# Altium schematic sheet LPCB224 - OVERVIEW.SchDoc
size A3; Address1: Factory 10; Address2: 9-13 Dingley Avenue, Dandeong, VICTORIA 3175, AUSTRALIA; DocumentNumber: 1; Revision: 1; SheetNumber: 1; SheetTotal: 7; Lockie__PCB_SUB_ASSEMBLY: Overview; Lockie__PCB_ASSEMBLY: Core Node; Lockie__LDL: LPCB224; Lockie__PCB_DESCRIPTION: Core Node
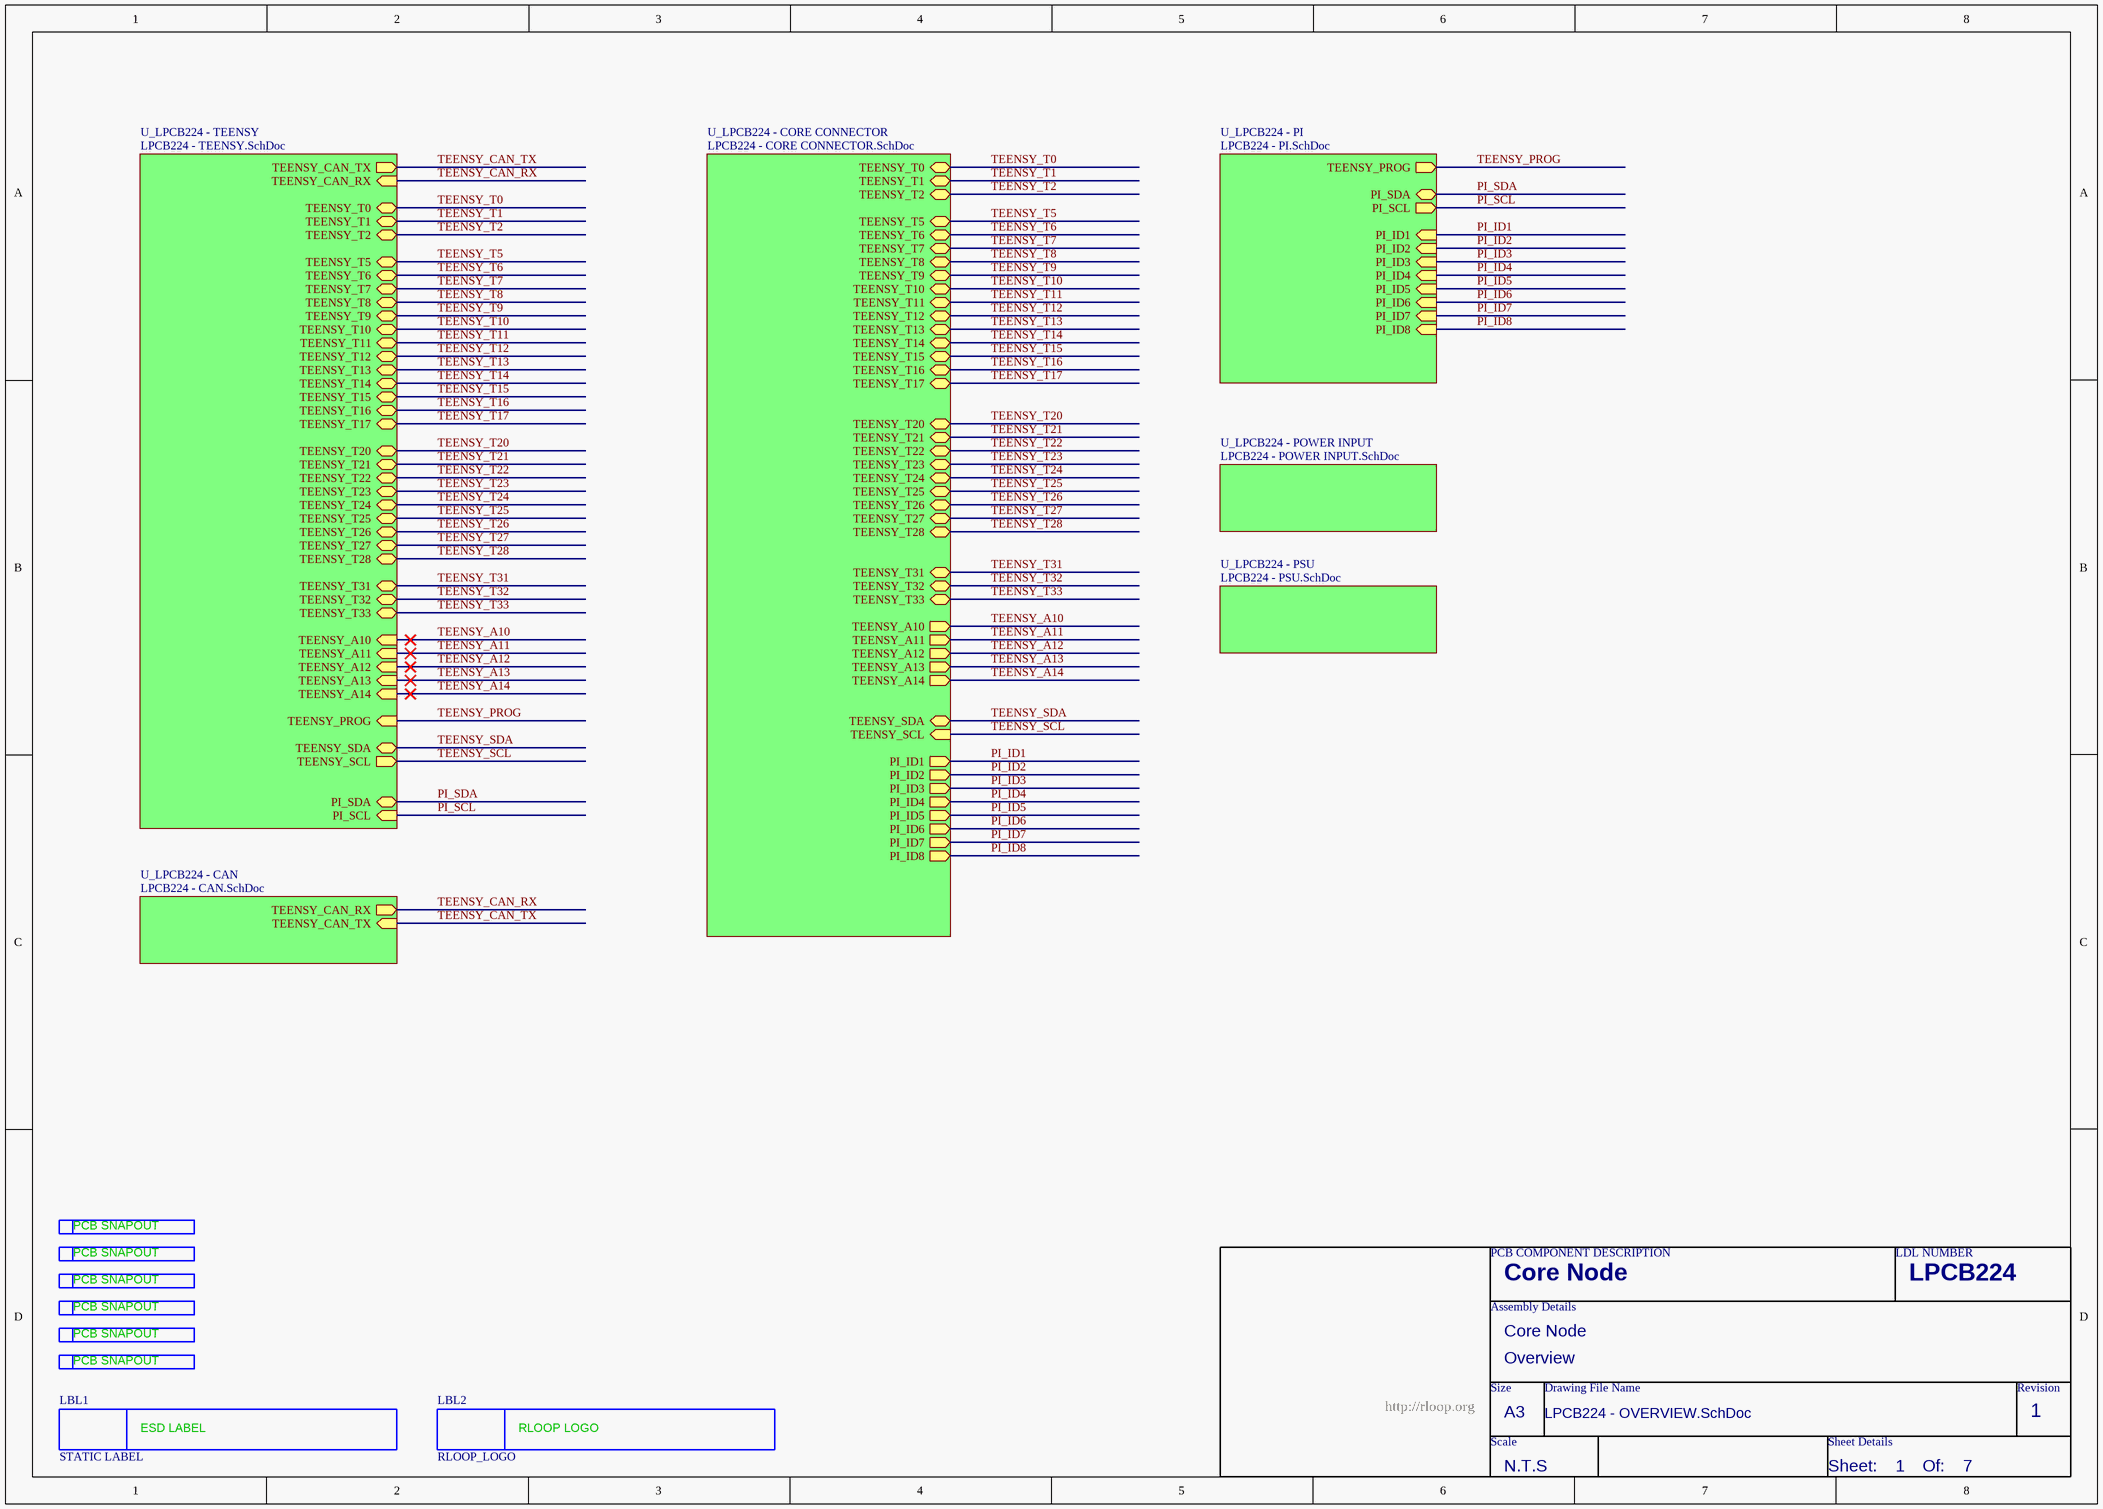
[diagram p0: LPCB224 - OVERVIEW.SchDoc]

## Parts
LBL1  STATIC LABEL  [STATIC_LABEL]  (no BOM)
LBL2  RLOOP_LOGO  [RLOOP_LOGO]  (no BOM)
SN1  PCB_SNAPOUT  [SNAPOUT_NEW]  (value not drawn)  (no BOM)
SN2  PCB_SNAPOUT  [SNAPOUT_NEW]  (value not drawn)  (no BOM)
SN3  PCB_SNAPOUT  [SNAPOUT_NEW]  (value not drawn)  (no BOM)
SN4  PCB_SNAPOUT  [SNAPOUT_NEW]  (value not drawn)  (no BOM)
SN5  PCB_SNAPOUT  [SNAPOUT_NEW]  (value not drawn)  (no BOM)
SN6  PCB_SNAPOUT  [SNAPOUT_NEW]  (value not drawn)  (no BOM)

## Sub-sheets
U_LPCB224 - CAN = LPCB224 - CAN.SchDoc: TEENSY_CAN_TX (in), TEENSY_CAN_RX (out)
U_LPCB224 - CORE CONNECTOR = LPCB224 - CORE CONNECTOR.SchDoc: TEENSY_T0 (bidir), TEENSY_T1 (bidir), TEENSY_T2 (bidir), TEENSY_T5 (bidir), TEENSY_T6 (bidir), TEENSY_T7 (bidir), TEENSY_T8 (bidir), TEENSY_T9 (bidir), TEENSY_T10 (bidir), TEENSY_T11 (bidir), TEENSY_T12 (bidir), TEENSY_T13 (bidir), TEENSY_T14 (bidir), TEENSY_T15 (bidir), TEENSY_T16 (bidir), TEENSY_T17 (bidir), TEENSY_T20 (bidir), TEENSY_T21 (bidir), TEENSY_T22 (bidir), TEENSY_T23 (bidir), TEENSY_T24 (bidir), TEENSY_T25 (bidir), TEENSY_T26 (bidir), TEENSY_T27 (bidir), TEENSY_T28 (bidir), TEENSY_T31 (bidir), TEENSY_T32 (bidir), TEENSY_T33 (bidir), TEENSY_A10 (out), TEENSY_A11 (out), TEENSY_A12 (out), TEENSY_A13 (out), TEENSY_A14 (out), TEENSY_SCL (in), TEENSY_SDA (bidir), PI_ID1 (out), PI_ID2 (out), PI_ID3 (out), PI_ID4 (out), PI_ID5 (out), PI_ID6 (out), PI_ID7 (out), PI_ID8 (out)
U_LPCB224 - PI = LPCB224 - PI.SchDoc: PI_ID1 (in), PI_ID2 (in), PI_ID3 (in), PI_ID4 (in), PI_ID5 (in), PI_ID6 (in), PI_ID7 (in), PI_ID8 (in), PI_SDA (bidir), PI_SCL (out), TEENSY_PROG (out)
U_LPCB224 - POWER INPUT = LPCB224 - POWER INPUT.SchDoc: no entries
U_LPCB224 - PSU = LPCB224 - PSU.SchDoc: no entries
U_LPCB224 - TEENSY = LPCB224 - TEENSY.SchDoc: TEENSY_T0 (bidir), TEENSY_T1 (bidir), TEENSY_T2 (bidir), TEENSY_CAN_TX (out), TEENSY_CAN_RX (in), TEENSY_T5 (bidir), TEENSY_T6 (bidir), TEENSY_T7 (bidir), TEENSY_T8 (bidir), TEENSY_T9 (bidir), TEENSY_T10 (bidir), TEENSY_T11 (bidir), TEENSY_T12 (bidir), TEENSY_T13 (bidir), TEENSY_T14 (bidir), TEENSY_T15 (bidir), TEENSY_T16 (bidir), TEENSY_T17 (bidir), TEENSY_T20 (bidir), TEENSY_T21 (bidir), TEENSY_T22 (bidir), TEENSY_T23 (bidir), TEENSY_T24 (bidir), TEENSY_T25 (bidir), TEENSY_T26 (bidir), TEENSY_T27 (bidir), TEENSY_T28 (bidir), TEENSY_T31 (bidir), TEENSY_T32 (bidir), TEENSY_T33 (bidir), TEENSY_A10 (in), TEENSY_A11 (in), TEENSY_A12 (in), TEENSY_A13 (in), TEENSY_A14 (in), TEENSY_PROG (in), TEENSY_SCL (out), TEENSY_SDA (bidir), PI_SCL (in), PI_SDA (bidir)

## Nets
PI_ID1: sheet U_LPCB224 - PI/PI_ID1, sheet U_LPCB224 - CORE CONNECTOR/PI_ID1
PI_ID2: sheet U_LPCB224 - PI/PI_ID2, sheet U_LPCB224 - CORE CONNECTOR/PI_ID2
PI_ID3: sheet U_LPCB224 - PI/PI_ID3, sheet U_LPCB224 - CORE CONNECTOR/PI_ID3
PI_ID4: sheet U_LPCB224 - PI/PI_ID4, sheet U_LPCB224 - CORE CONNECTOR/PI_ID4
PI_ID5: sheet U_LPCB224 - PI/PI_ID5, sheet U_LPCB224 - CORE CONNECTOR/PI_ID5
PI_ID6: sheet U_LPCB224 - PI/PI_ID6, sheet U_LPCB224 - CORE CONNECTOR/PI_ID6
PI_ID7: sheet U_LPCB224 - PI/PI_ID7, sheet U_LPCB224 - CORE CONNECTOR/PI_ID7
PI_ID8: sheet U_LPCB224 - PI/PI_ID8, sheet U_LPCB224 - CORE CONNECTOR/PI_ID8
PI_SCL: sheet U_LPCB224 - TEENSY/PI_SCL, sheet U_LPCB224 - PI/PI_SCL
PI_SDA: sheet U_LPCB224 - TEENSY/PI_SDA, sheet U_LPCB224 - PI/PI_SDA
TEENSY_A10: sheet U_LPCB224 - TEENSY/TEENSY_A10, sheet U_LPCB224 - CORE CONNECTOR/TEENSY_A10
TEENSY_A11: sheet U_LPCB224 - TEENSY/TEENSY_A11, sheet U_LPCB224 - CORE CONNECTOR/TEENSY_A11
TEENSY_A12: sheet U_LPCB224 - TEENSY/TEENSY_A12, sheet U_LPCB224 - CORE CONNECTOR/TEENSY_A12
TEENSY_A13: sheet U_LPCB224 - TEENSY/TEENSY_A13, sheet U_LPCB224 - CORE CONNECTOR/TEENSY_A13
TEENSY_A14: sheet U_LPCB224 - TEENSY/TEENSY_A14, sheet U_LPCB224 - CORE CONNECTOR/TEENSY_A14
TEENSY_CAN_RX: sheet U_LPCB224 - TEENSY/TEENSY_CAN_RX, sheet U_LPCB224 - CAN/TEENSY_CAN_RX
TEENSY_CAN_TX: sheet U_LPCB224 - TEENSY/TEENSY_CAN_TX, sheet U_LPCB224 - CAN/TEENSY_CAN_TX
TEENSY_PROG: sheet U_LPCB224 - TEENSY/TEENSY_PROG, sheet U_LPCB224 - PI/TEENSY_PROG
TEENSY_SCL: sheet U_LPCB224 - TEENSY/TEENSY_SCL, sheet U_LPCB224 - CORE CONNECTOR/TEENSY_SCL
TEENSY_SDA: sheet U_LPCB224 - TEENSY/TEENSY_SDA, sheet U_LPCB224 - CORE CONNECTOR/TEENSY_SDA
TEENSY_T0: sheet U_LPCB224 - TEENSY/TEENSY_T0, sheet U_LPCB224 - CORE CONNECTOR/TEENSY_T0
TEENSY_T1: sheet U_LPCB224 - TEENSY/TEENSY_T1, sheet U_LPCB224 - CORE CONNECTOR/TEENSY_T1
TEENSY_T2: sheet U_LPCB224 - TEENSY/TEENSY_T2, sheet U_LPCB224 - CORE CONNECTOR/TEENSY_T2
TEENSY_T5: sheet U_LPCB224 - TEENSY/TEENSY_T5, sheet U_LPCB224 - CORE CONNECTOR/TEENSY_T5
TEENSY_T6: sheet U_LPCB224 - TEENSY/TEENSY_T6, sheet U_LPCB224 - CORE CONNECTOR/TEENSY_T6
TEENSY_T7: sheet U_LPCB224 - TEENSY/TEENSY_T7, sheet U_LPCB224 - CORE CONNECTOR/TEENSY_T7
TEENSY_T8: sheet U_LPCB224 - TEENSY/TEENSY_T8, sheet U_LPCB224 - CORE CONNECTOR/TEENSY_T8
TEENSY_T9: sheet U_LPCB224 - TEENSY/TEENSY_T9, sheet U_LPCB224 - CORE CONNECTOR/TEENSY_T9
TEENSY_T10: sheet U_LPCB224 - TEENSY/TEENSY_T10, sheet U_LPCB224 - CORE CONNECTOR/TEENSY_T10
TEENSY_T11: sheet U_LPCB224 - TEENSY/TEENSY_T11, sheet U_LPCB224 - CORE CONNECTOR/TEENSY_T11
TEENSY_T12: sheet U_LPCB224 - TEENSY/TEENSY_T12, sheet U_LPCB224 - CORE CONNECTOR/TEENSY_T12
TEENSY_T13: sheet U_LPCB224 - TEENSY/TEENSY_T13, sheet U_LPCB224 - CORE CONNECTOR/TEENSY_T13
TEENSY_T14: sheet U_LPCB224 - TEENSY/TEENSY_T14, sheet U_LPCB224 - CORE CONNECTOR/TEENSY_T14
TEENSY_T15: sheet U_LPCB224 - TEENSY/TEENSY_T15, sheet U_LPCB224 - CORE CONNECTOR/TEENSY_T15
TEENSY_T16: sheet U_LPCB224 - TEENSY/TEENSY_T16, sheet U_LPCB224 - CORE CONNECTOR/TEENSY_T16
TEENSY_T17: sheet U_LPCB224 - TEENSY/TEENSY_T17, sheet U_LPCB224 - CORE CONNECTOR/TEENSY_T17
TEENSY_T20: sheet U_LPCB224 - TEENSY/TEENSY_T20, sheet U_LPCB224 - CORE CONNECTOR/TEENSY_T20
TEENSY_T21: sheet U_LPCB224 - TEENSY/TEENSY_T21, sheet U_LPCB224 - CORE CONNECTOR/TEENSY_T21
TEENSY_T22: sheet U_LPCB224 - TEENSY/TEENSY_T22, sheet U_LPCB224 - CORE CONNECTOR/TEENSY_T22
TEENSY_T23: sheet U_LPCB224 - TEENSY/TEENSY_T23, sheet U_LPCB224 - CORE CONNECTOR/TEENSY_T23
TEENSY_T24: sheet U_LPCB224 - TEENSY/TEENSY_T24, sheet U_LPCB224 - CORE CONNECTOR/TEENSY_T24
TEENSY_T25: sheet U_LPCB224 - TEENSY/TEENSY_T25, sheet U_LPCB224 - CORE CONNECTOR/TEENSY_T25
TEENSY_T26: sheet U_LPCB224 - TEENSY/TEENSY_T26, sheet U_LPCB224 - CORE CONNECTOR/TEENSY_T26
TEENSY_T27: sheet U_LPCB224 - TEENSY/TEENSY_T27, sheet U_LPCB224 - CORE CONNECTOR/TEENSY_T27
TEENSY_T28: sheet U_LPCB224 - TEENSY/TEENSY_T28, sheet U_LPCB224 - CORE CONNECTOR/TEENSY_T28
TEENSY_T31: sheet U_LPCB224 - TEENSY/TEENSY_T31, sheet U_LPCB224 - CORE CONNECTOR/TEENSY_T31
TEENSY_T32: sheet U_LPCB224 - TEENSY/TEENSY_T32, sheet U_LPCB224 - CORE CONNECTOR/TEENSY_T32
TEENSY_T33: sheet U_LPCB224 - TEENSY/TEENSY_T33, sheet U_LPCB224 - CORE CONNECTOR/TEENSY_T33

## Notes on the sheet
- PCB COMPONENT DESCRIPTION
- LDL NUMBER
- Assembly Details
- Size
- Drawing File Name
- Revision
- http://rloop.org
- Scale
- A3
- Sheet Details
- N.T.S
- Sheet:
- Of:
- (in symbol PCB_SNAPOUT) PCB SNAPOUT
- (in symbol RLOOP_LOGO) RLOOP LOGO
- (in symbol STATIC LABEL) ESD LABEL

## Library data of the parts
LBL1 = STATIC LABEL: FMEDA__CHANNEL: DIAG; FMEDA__FUNCTION_IN_SYSTEM: *
LBL2 = RLOOP_LOGO: FMEDA__CHANNEL: DIAG; FMEDA__FUNCTION_IN_SYSTEM: *
SN1-SN6 = PCB_SNAPOUT: FMEDA__CHANNEL: DIAG; FMEDA__FUNCTION_IN_SYSTEM: *